# Altium schematic sheet Safety_2019_V_3_0_TC.SchDoc
size A
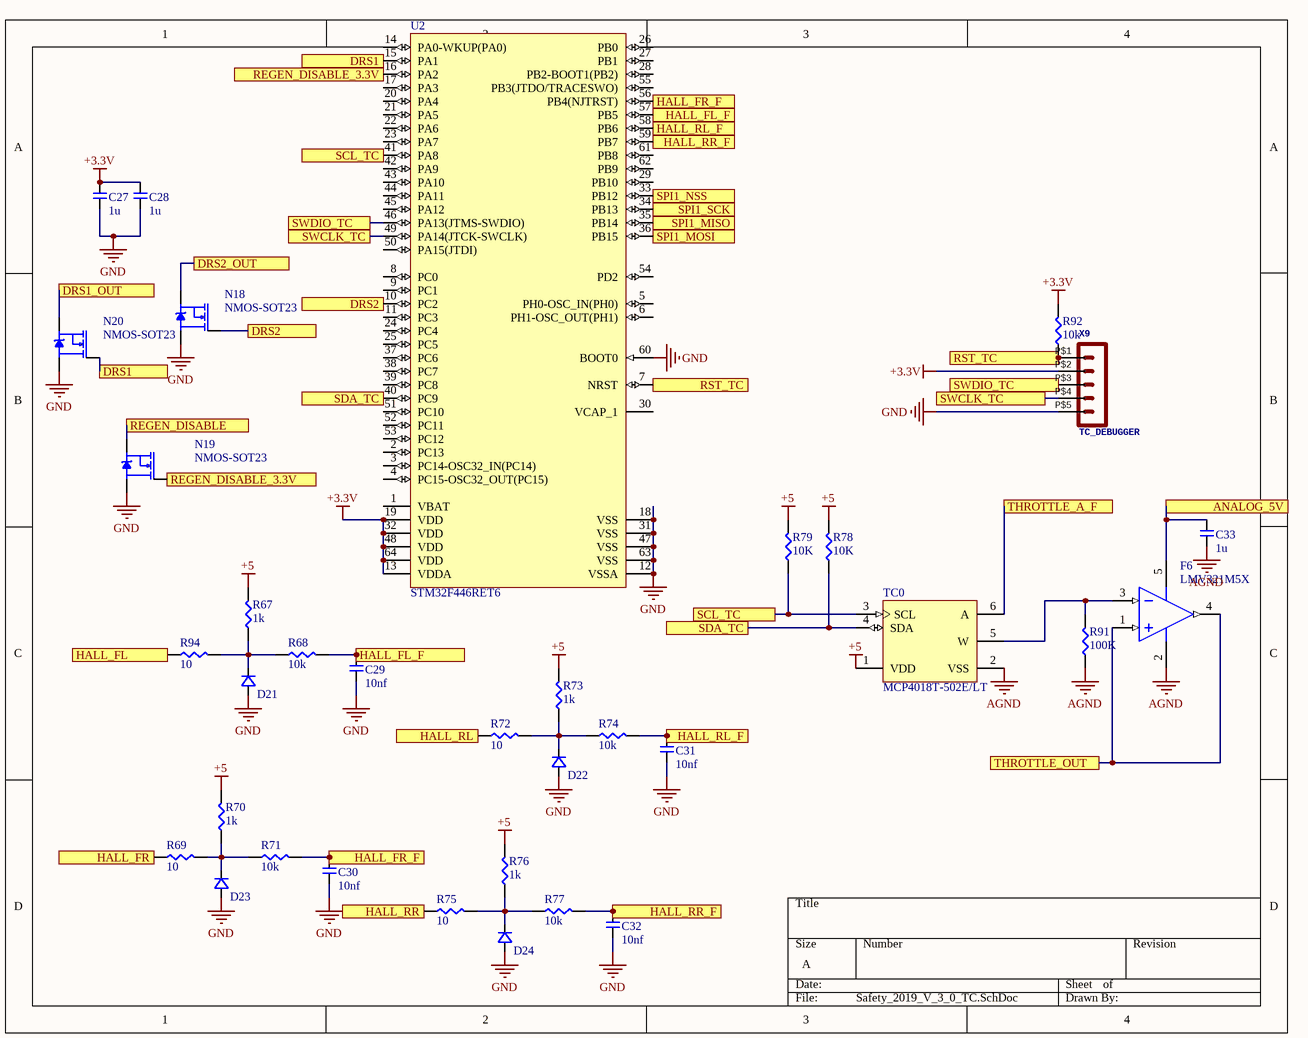
[diagram p0: Safety_2019_V_3_0_TC.SchDoc]

## Parts
C27  1u  [CAP-0603]
C28  1u  [CAP-0603]
C29  10nf  [CAP-0603]
C30  10nf  [CAP-0603]
C31  10nf  [CAP-0603]
C32  10nf  [CAP-0603]
C33  1u  [CAP-0603]
D21  ?  [SOD123]  (value not drawn)
D22  ?  [SOD123]  (value not drawn)
D23  ?  [SOD123]  (value not drawn)
D24  ?  [SOD123]  (value not drawn)
F6  LMV321M5X  [MF05A_N]
N18  NMOS-SOT23  [SOT23]
N19  NMOS-SOT23  [SOT23]
N20  NMOS-SOT23  [SOT23]
R67  1k  [RES-0603]
R68  10k  [RES-0603]
R69  10  [RES-0603]
R70  1k  [RES-0603]
R71  10k  [RES-0603]
R72  10  [RES-0603]
R73  1k  [RES-0603]
R74  10k  [RES-0603]
R75  10  [RES-0603]
R76  1k  [RES-0603]
R77  10k  [RES-0603]
R78  10K  [RES-0603]
R79  10K  [RES-0603]
R91  100K  [RES-0603]
R92  10k  [RES-0603]
R94  10  [RES-0603]
TC0  MCP4018T-502E/LT  [SC70-LT6_L]
U2  STM32F446RET6  [STM-LQFP64_L]
X9  TC_DEBUGGER  [POS5_254MM_MALE]

## Ports
ANALOG_5V, DRS1, DRS1_OUT, DRS2, DRS2_OUT, HALL_FL, HALL_FL_F, HALL_FR, HALL_FR_F, HALL_RL, HALL_RL_F, HALL_RR, HALL_RR_F, REGEN_DISABLE, REGEN_DISABLE_3.3V, RST_TC, SCL_TC, SDA_TC, SPI1_MISO, SPI1_MOSI, SPI1_NSS, SPI1_SCK, SWCLK_TC, SWDIO_TC, THROTTLE_A_F, THROTTLE_OUT

## Nets
+3.3V: C27.2 C28.2 R92.2 U2.13(VDDA) U2.19(VDD) U2.32(VDD) U2.48(VDD) U2.64(VDD) X9.P$2
+5: R67.2 R70.2 R73.2 R76.2 R78.2 R79.2 TC0.1(VDD)
AGND: C33.1 F6.2(V-) R91.1 TC0.2(VSS)
GND: C27.1 C28.1 C29.1 C30.1 C31.1 C32.1 D21.A D22.A D23.A D24.A N18.2(S) N19.2(S) N20.2(S) U2.12(VSSA) U2.18(VSS) U2.31(VSS) U2.47(VSS) U2.60(BOOT0) U2.63(VSS) X9.P$5
ANALOG_5V: C33.2 F6.5(V+) ; port ANALOG_5V
DRS1: N20.1(G) U2.15(PA1) ; port DRS1
DRS1_OUT: N20.3(D) ; port DRS1_OUT
DRS2: N18.1(G) U2.10(PC2) ; port DRS2
DRS2_OUT: N18.3(D) ; port DRS2_OUT
HALL_FL: R94.1 ; port HALL_FL
HALL_FL_F: C29.2 R68.2 U2.57(PB5) ; port HALL_FL_F
HALL_FR: R69.1 ; port HALL_FR
HALL_FR_F: C30.2 R71.2 U2.56(PB4(NJTRST)) ; port HALL_FR_F
HALL_RL: R72.1 ; port HALL_RL
HALL_RL_F: C31.2 R74.2 U2.58(PB6) ; port HALL_RL_F
HALL_RR: R75.1 ; port HALL_RR
HALL_RR_F: C32.2 R77.2 U2.59(PB7) ; port HALL_RR_F
REGEN_DISABLE: N19.3(D) ; port REGEN_DISABLE
REGEN_DISABLE_3.3V: N19.1(G) U2.16(PA2) ; port REGEN_DISABLE_3.3V
RST_TC: R92.1 U2.7(NRST) X9.P$1 ; port RST_TC
SCL_TC: R79.1 TC0.3(SCL) U2.41(PA8) ; port SCL_TC
SDA_TC: R78.1 TC0.4(SDA) U2.40(PC9) ; port SDA_TC
SPI1_MISO: U2.35(PB14) ; port SPI1_MISO
SPI1_MOSI: U2.36(PB15) ; port SPI1_MOSI
SPI1_NSS: U2.33(PB12) ; port SPI1_NSS
SPI1_SCK: U2.34(PB13) ; port SPI1_SCK
SWCLK_TC: U2.49(PA14(JTCK-SWCLK)) X9.P$4 ; port SWCLK_TC
SWDIO_TC: U2.46(PA13(JTMS-SWDIO)) X9.P$3 ; port SWDIO_TC
THROTTLE_A_F: TC0.6(A) ; port THROTTLE_A_F
THROTTLE_OUT: F6.1(IN+) F6.4(OUT) ; port THROTTLE_OUT
NetD21_K: D21.K R67.1 R68.1 R94.2
NetD22_K: D22.K R72.2 R73.1 R74.1
NetD23_K: D23.K R69.2 R70.1 R71.1
NetD24_K: D24.K R75.2 R76.1 R77.1
NetF6_3: F6.3(IN-) R91.2 TC0.5(W)

Not connected (* = marked no-connect by the designer): U2 1(VBAT) 2(PC13) 3(PC14-OSC32_IN(PC14)) 4(PC15-OSC32_OUT(PC15)) 5(PH0-OSC_IN(PH0)) 6(PH1-OSC_OUT(PH1)) 8(PC0) 9(PC1) 11(PC3) 14(PA0-WKUP(PA0)) 17(PA3) 20(PA4) 21(PA5) 22(PA6) 23(PA7) 24(PC4) 25(PC5) 26(PB0) 27(PB1) 28(PB2-BOOT1(PB2)) 29(PB10) 30(VCAP_1) 37(PC6) 38(PC7) 39(PC8) 42(PA9) 43(PA10) 44(PA11) 45(PA12) 50(PA15(JTDI)) 51(PC10) 52(PC11) 53(PC12) 54(PD2) 55(PB3(JTDO/TRACESWO)) 61(PB8) 62(PB9)

## Library data of the parts
C27-C33 = CAP-0603
D21-D24 = DIODE-SOD123
F6 = CMP-0055-01048-2: General Purpose, Low Voltage, Rail-to-Rail Output Operational Amplifiers, 5-pin SOT-23; Manufacturer: National Semiconductor; PackageTopMarking: A13*XTT; PowerWise: N; ComponentLink2URL: http://www.national.com/pf/LM/LMV321.html; ComponentLink1Description: LMV321 Datasheet; PackageReference: MF05A; ComponentLink3Description: MF05A Package Page; ComponentLink2Description: LMV321 Web Page; CompType: Amplifiers; ComponentLink1URL: http://www.national.com/ds/LM/LMV321.pdf; ComponentLink3URL: http://www.national.com/packaging/folders/mf05a.html; PinCount: 5; PackageDescription: Molded SOT-23, .115 x .063 x .040 in Body, 5 Lead, .0375 in Pitch; PackageVersion: revD, Aug-2008; RevisionNote: Component URLs added; DatasheetVersion: Sep-2009; RoHS: N
R67-R79 R91 R92 R94 = RES-0603
TC0 = CMP-0188-00771-2: 7-Bit Single I2C Digital POT with Volatile Memory, 6-pin SC70, Extended Temperature, Tape and Reel; PackageDescription: 6-Lead Plastic Small Outline Transistor (LT) [SC70]; DatasheetVersion: revA, Mar-2009; ComponentLink1URL: http://www.microchip.com/; ComponentLink1Description: Manufacturer URL; ComponentLink3Description: Package Specification; ComponentLink3URL: http://www.microchip.com/stellent/groups/techpub_sg/documents/packagingspec/en012702.pdf; ComponentLink2Description: Datasheet; PackageVersion: revBB, Aug-2009; ComponentLink2URL: http://ww1.microchip.com/downloads/en/DeviceDoc/22147a.pdf; PackageReference: SC70-LT6; RevisionNote: URLs added.
U2 = CMP-0243-00218-1: ARM Cortex-M4 32-bit MCU+FPU, 512 KB Flash, 128 KB Internal RAM, 50 I/Os, 64-Pin LQFP, -40 to 85 degC, Tray; I/Os (High Current): 50; Supply Voltage(Vcc) min (V): 1.7; Operating Frequency(F) (Processor speed) (MHz): 180; D/A Converter: 2; Internal RAM Size (kB): 128; FLASH Size (Prog) (kB): 512; Core: ARM Cortex-M4; ComponentLink1Description: Manufacturer URL; Package Reference: 64-Pin Low-profile Quad Flat Package, Body 10 x 10 mm, Pitch 0.5 mm; ComponentLink2URL: http://www.st.com/st-web-ui/static/active/en/resource/technical/document/datasheet/DM00141306.pdf; Packing: Tray; DatasheetVersion: Rev. 6; ComponentLink1URL: http://www.st.com/; ComponentLink2Description: Datasheet; Package Description: LQFP64; Mounting Technology: Surface Mount
X9 = POS5_254MM_MALE: GateName_1: G$1; SymbolName_1: HEADER_POS5; DeviceName: 43650-0524; DeviceSetName: HEADER_POS5_?; LibraryName: MOLEX Micro-Fit; Package: 43650-0524